# EAGLE design ESP32_EIT (EAGLE 9.7.0)
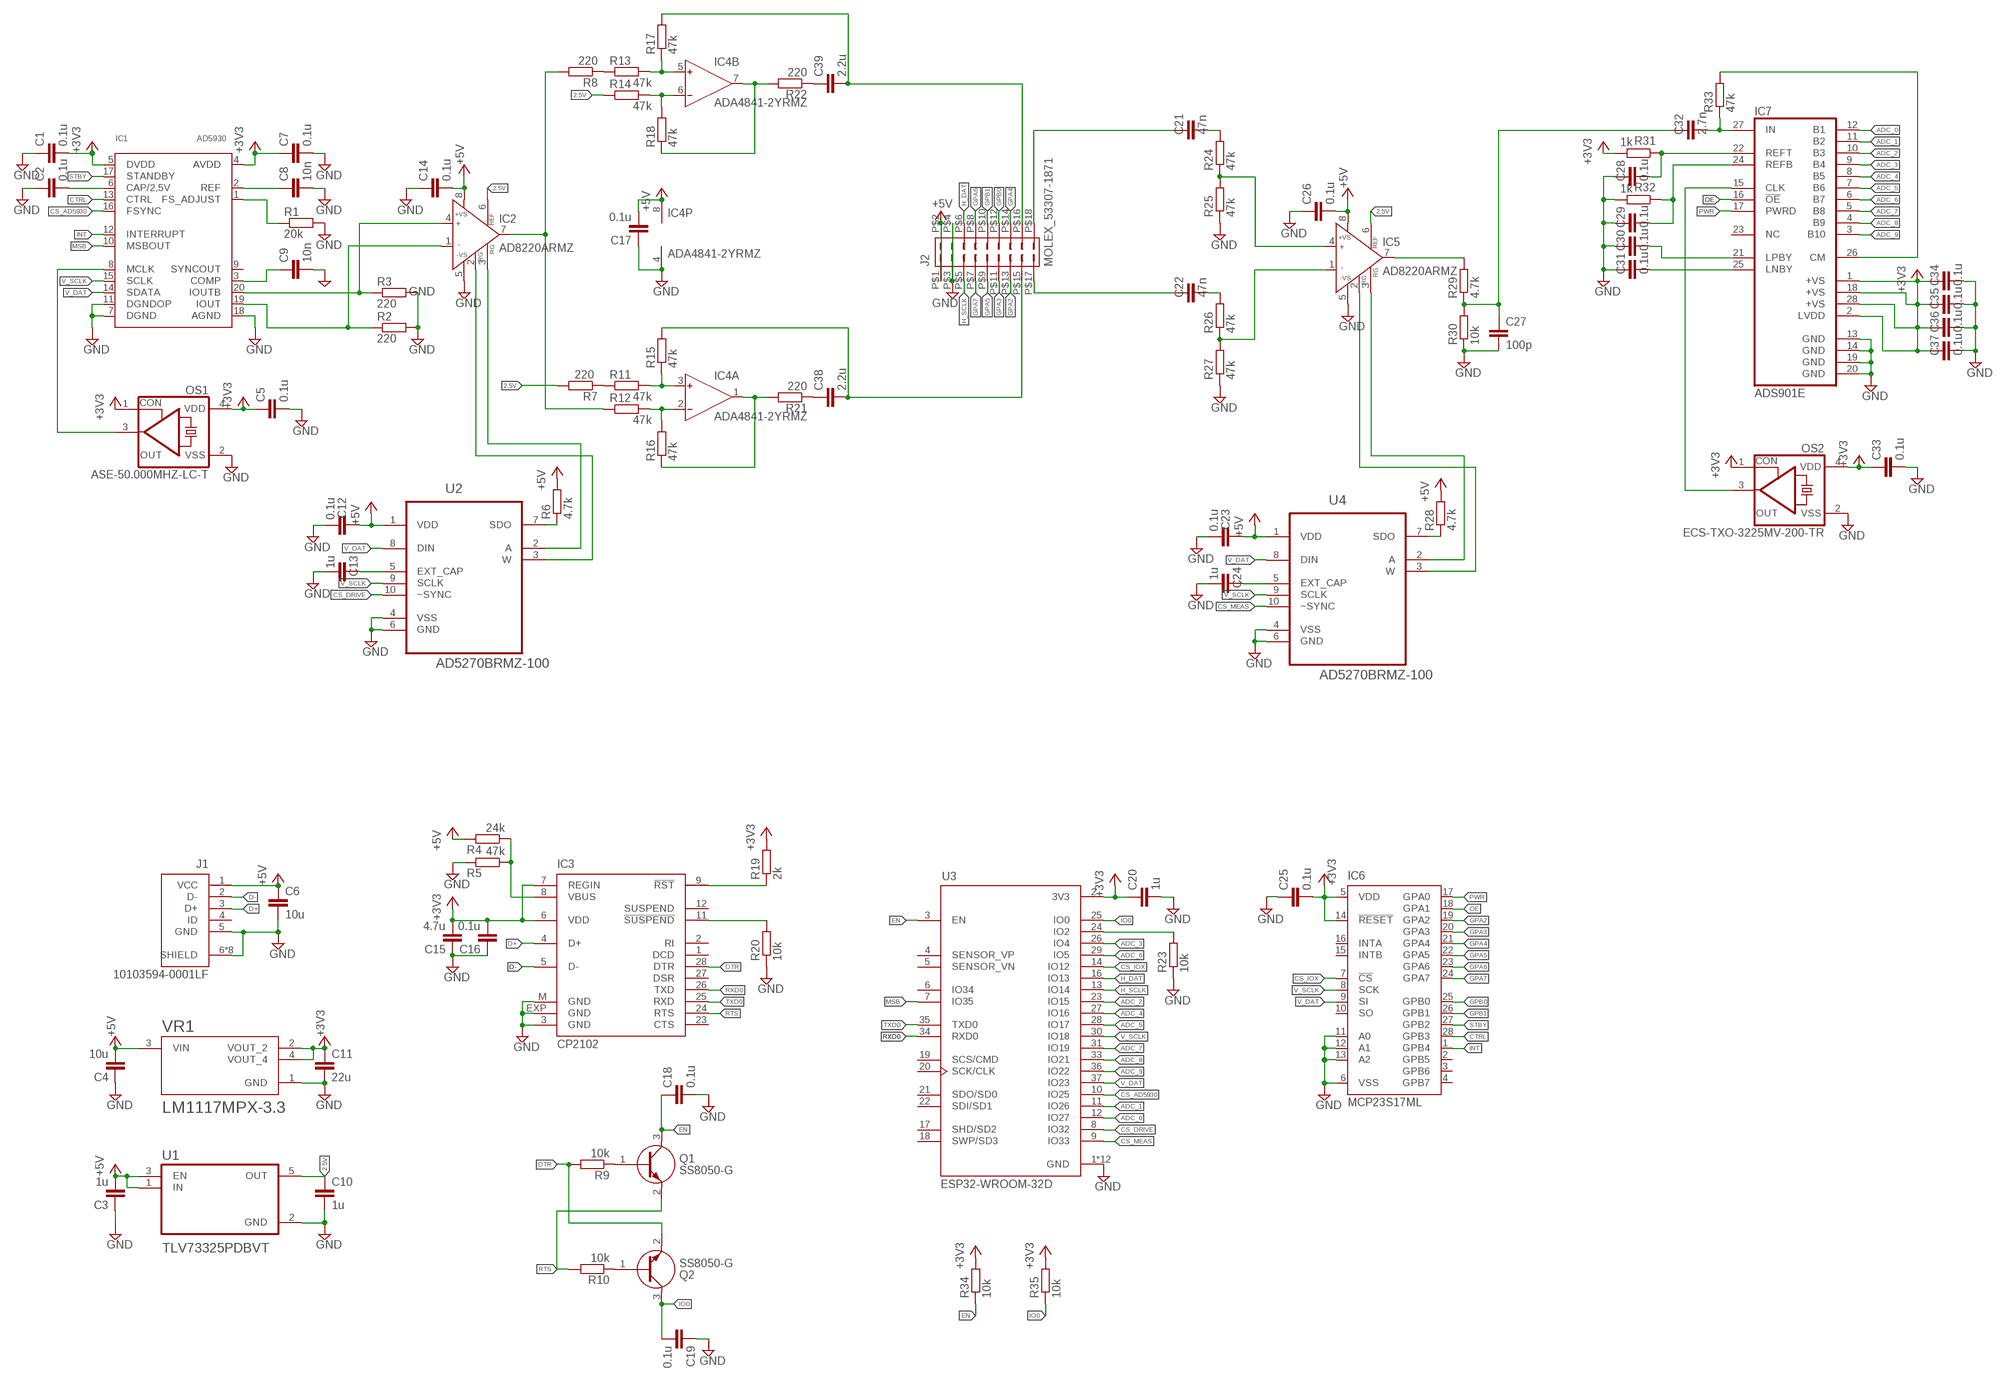
[diagram p0: schematic, sheet 1]

## Parts
C1  0.1u  C-EUC0603  [C0603]
C2  0.1u  C-EUC0603  [C0603]
C3  1u  C-EUC0603  [C0603]
C4  10u  C-EUC0805  [C0805]
C5  0.1u  C-EUC0603  [C0603]
C6  10u  C-EUC0805  [C0805]
C7  0.1u  C-EUC0603  [C0603]
C8  10n  C-EUC0603  [C0603]
C9  10n  C-EUC0603  [C0603]
C10  1u  C-EUC0603  [C0603]
C11  22u  C-EUC0805  [C0805]
C12  0.1u  C-EUC0603  [C0603]
C13  1u  C-EUC0603  [C0603]
C14  0.1u  C-EUC0603  [C0603]
C15  4.7u  C-EUC0603  [C0603]
C16  0.1u  C-EUC0603  [C0603]
C17  0.1u  C-EUC0603  [C0603]
C18  0.1u  C-EUC0603  [C0603]
C19  0.1u  C-EUC0603  [C0603]
C20  1u  C-EUC0603  [C0603]
C21  47n  C-EUC0603  [C0603]
C22  47n  C-EUC0603  [C0603]
C23  0.1u  C-EUC0603  [C0603]
C24  1u  C-EUC0603  [C0603]
C25  0.1u  C-EUC0603  [C0603]
C26  0.1u  C-EUC0603  [C0603]
C27  100p  C-EUC0603  [C0603]
C28  0.1u  C-EUC0603  [C0603]
C29  0.1u  C-EUC0603  [C0603]
C30  0.1u  C-EUC0603  [C0603]
C31  0.1u  C-EUC0603  [C0603]
C32  2.7n  C-EUC0603  [C0603]
C33  0.1u  C-EUC0603  [C0603]
C34  0.1u  C-EUC0603  [C0603]
C35  0.1u  C-EUC0603  [C0603]
C36  0.1u  C-EUC0603  [C0603]
C37  0.1u  C-EUC0603  [C0603]
C38  2.2u  C-EUC0603  [C0603]
C39  2.2u  C-EUC0603  [C0603]
IC1  AD5930  [TSSOP20]
IC2  AD8220ARMZ  [MSOP8]
IC3  CP2102  [MLP28]
IC4  ADA4841-2YRMZ  [MSOP8]
IC5  AD8220ARMZ  [MSOP8]
IC6  MCP23S17ML  [QFN28-ML_6X6MM]
IC7  ADS901E  [SSOP28BU]
J1  10103594-0001LF  [AMPHENOL_10103594-0001LF]
J2  MOLEX_53307-1871  [MOLEX_53307-1871]
OS1  ASE-50.000MHZ-LC-T  OSC-OE-IQXO-793  [2.5X2-4-PAD]
OS2  ECS-TXO-3225MV-200-TR  OSC-OE-IQXO-793  [2.5X2-4-PAD]
Q1  SS8050-G  [SOT95P240X115-3N]
Q2  SS8050-G  [SOT95P240X115-3N]
R1  20k  R-EU_R0603  [R0603]
R2  220  R-EU_R0603  [R0603]
R3  220  R-EU_R0603  [R0603]
R4  24k  R-EU_R0603  [R0603]
R5  47k  R-EU_R0603  [R0603]
R6  4.7k  R-EU_R0603  [R0603]
R7  220  R-EU_R0603  [R0603]
R8  220  R-EU_R0603  [R0603]
R9  10k  R-EU_R0603  [R0603]
R10  10k  R-EU_R0603  [R0603]
R11  47k  R-EU_R0603  [R0603]
R12  47k  R-EU_R0603  [R0603]
R13  47k  R-EU_R0603  [R0603]
R14  47k  R-EU_R0603  [R0603]
R15  47k  R-EU_R0603  [R0603]
R16  47k  R-EU_R0603  [R0603]
R17  47k  R-EU_R0603  [R0603]
R18  47k  R-EU_R0603  [R0603]
R19  2k  R-EU_R0603  [R0603]
R20  10k  R-EU_R0603  [R0603]
R21  220  R-EU_R0603  [R0603]
R22  220  R-EU_R0603  [R0603]
R23  10k  R-EU_R0603  [R0603]
R24  47k  R-EU_R0603  [R0603]
R25  47k  R-EU_R0603  [R0603]
R26  47k  R-EU_R0603  [R0603]
R27  47k  R-EU_R0603  [R0603]
R28  4.7k  R-EU_R0603  [R0603]
R29  4.7k  R-EU_R0603  [R0603]
R30  10k  R-EU_R0603  [R0603]
R31  1k  R-EU_R0603  [R0603]
R32  1k  R-EU_R0603  [R0603]
R33  47k  R-EU_R0603  [R0603]
R34  10k  R-EU_R0603  [R0603]
R35  10k  R-EU_R0603  [R0603]
U1  TLV73325PDBVT  [SOT95P280X145-5N]
U2  AD5270BRMZ-100  [SOP50P490X110-10N]
U3  ESP32-WROOM-32D  [MODULE_ESP32-WROOM-32D]
U4  AD5270BRMZ-100  [SOP50P490X110-10N]
VR1  LM1117MPX-3.3  [VREG_LM1117MPX-3.3]

## Nets
2.5V: C10.1 IC2.6(REF) IC5.6(REF) R7.2 R14.1 U1.5(OUT)
+3V3: C1.2 C5.1 C7.1 C11.1 C15.2 C16.2 C20.1 C25.2 C33.1 C34.1 C35.1 C36.1 C37.1 IC1.4(AVDD) IC1.5(DVDD) IC3.6(VDD) IC3.7(REGIN) IC6.5(VDD) IC6.14(!RESET) IC7.1(+VS) IC7.2(LVDD) IC7.18(+VS) IC7.28(+VS) OS1.1(CON) OS1.4(VDD) OS2.1(CON) OS2.4(VDD) R19.2 R31.2 R34.2 R35.2 U3.2(3V3) VR1.2(VOUT_2) VR1.4(VOUT_4)
+5V: C3.2 C4.2 C6.1 C12.1 C14.2 C17.2 C23.1 C26.2 IC2.8(+VS) IC4.8(P:V+) IC5.8(+VS) J1.1(VCC) J2.P$1 J2.P$2 R4.2 R6.2 R28.2 U1.1(IN) U1.3(EN) U2.1(VDD) U4.1(VDD) VR1.3(VIN)
ADC_0: IC7.12(B1) U3.12(IO27)
ADC_1: IC7.11(B2) U3.11(IO26)
ADC_2: IC7.10(B3) U3.23(IO15)
ADC_3: IC7.9(B4) U3.26(IO4)
ADC_4: IC7.8(B5) U3.27(IO16)
ADC_5: IC7.7(B6) U3.28(IO17)
ADC_6: IC7.6(B7) U3.29(IO5)
ADC_7: IC7.5(B8) U3.31(IO19)
ADC_8: IC7.4(B9) U3.33(IO21)
ADC_9: IC7.3(B10) U3.36(IO22)
CS_AD5930: IC1.16(FSYNC) U3.10(IO25)
CS_DRIVE: U2.10(~SYNC) U3.8(IO32)
CS_IOX: IC6.7(!CS) U3.14(IO12)
CS_MEAS: U3.9(IO33) U4.10(~SYNC)
CTRL: IC1.13(CTRL) IC6.28(GPB3)
D+: IC3.4(D+) J1.3(D+)
D-: IC3.5(D-) J1.2(D-)
DTR: IC3.28(DTR) Q2.2(E) R9.2
EN: C18.1 Q1.3(C) R34.1 U3.3(EN)
GND: C1.1 C2.1 C3.1 C4.1 C5.2 C6.2 C7.2 C8.2 C9.2 C10.2 C11.2 C12.2 C13.2 C14.1 C15.1 C16.1 C17.1 C18.2 C19.1 C20.2 C23.2 C24.2 C25.1 C26.1 C27.2 C28.1 C29.1 C30.1 C31.1 C33.2 C34.2 C35.2 C36.2 C37.2 IC1.7(DGND) IC1.11(DGNDOP) IC1.18(AGND) IC2.5(-VS) IC3.3(GND) IC3.EXP(GND) IC3.M(GND) IC4.4(P:V-) IC5.5(-VS) IC6.6(VSS) IC6.11(A0) IC6.12(A1) IC6.13(A2) IC7.13(GND) IC7.14(GND) IC7.19(GND) IC7.20(GND) J1.5(GND) J1.6(SHIELD) J1.7(SHIELD) J1.8(SHIELD) J1.9(SHIELD) J1.10(SHIELD) J1.11(SHIELD) J1.S1(SHIELD) J1.S2(SHIELD) J2.P$3 J2.P$4 OS1.2(VSS) OS2.2(VSS) R1.2 R2.2 R3.2 R5.2 R20.1 R23.1 R25.1 R27.1 R30.1 R32.2 U1.2(GND) U2.4(VSS) U2.6(GND) U3.1(GND) U3.15(GND) U3.38(GND) U3.39_1(GND) U3.39_2(GND) U3.39_3(GND) U3.39_4(GND) U3.39_5(GND) U3.39_6(GND) U3.39_7(GND) U3.39_8(GND) U3.39_9(GND) U4.4(VSS) U4.6(GND) VR1.1(GND)
GPA2: IC6.19(GPA2) J2.P$13
GPA3: IC6.20(GPA3) J2.P$11
GPA4: IC6.21(GPA4) J2.P$14
GPA5: IC6.22(GPA5) J2.P$9
GPA6: IC6.23(GPA6) J2.P$8
GPA7: IC6.24(GPA7) J2.P$7
GPB0: IC6.25(GPB0) J2.P$12
GPB1: IC6.26(GPB1) J2.P$10
H_DAT: J2.P$6 U3.16(IO13)
H_SCLK: J2.P$5 U3.13(IO14)
INT: IC1.12(INTERRUPT) IC6.1(GPB4)
IO0: C19.2 Q2.3(C) R35.1 U3.25(IO0)
MSB: IC1.10(MSBOUT) U3.7(IO35)
N$1: IC1.1(FS_ADJUST) R1.1
N$2: C8.1 IC1.2(REF)
N$3: C9.1 IC1.3(COMP)
N$4: IC1.20(IOUTB) IC2.4(IN+) R3.1
N$6: R7.1 R11.1
N$7: R8.1 R13.1
N$8: IC4.6(B:IN-) R14.2 R18.2
N$9: IC4.5(B:IN+) R13.2 R17.1
N$10: IC4.3(A:IN+) R11.2 R15.1
N$11: IC4.2(A:IN-) R12.2 R16.2
N$12: IC4.1(A:OUT) R16.1 R21.2
N$13: IC1.8(MCLK) OS1.3(OUT)
N$14: C2.2 IC1.6(CAP/2,5V)
N$15: IC4.7(B:OUT) R18.1 R22.2
N$16: R6.1 U2.7(SDO)
N$18: IC1.19(IOUT) IC2.1(IN-) R2.1
N$19: IC2.2(RG) U2.3(W)
N$20: IC2.7(OUT) R8.2 R12.1
N$21: IC2.3(RG) U2.2(A)
N$22: C13.1 U2.5(EXT_CAP)
N$23: R28.1 U4.7(SDO)
N$24: IC7.26(CM) R33.2
N$25: C32.2 IC7.27(IN) R33.1
N$26: C24.1 U4.5(EXT_CAP)
N$27: C28.2 IC7.22(REFT) R31.1
N$28: C29.2 IC7.24(REFB) R32.1
N$29: C31.2 IC7.25(LNBY)
N$30: C30.2 IC7.21(LPBY)
N$31: IC5.2(RG) U4.3(W)
N$32: IC7.15(CLK) OS2.3(OUT)
N$33: IC5.7(OUT) R29.2
N$34: C21.2 R24.2
N$35: IC5.4(IN+) R24.1 R25.2
N$36: IC5.1(IN-) R26.1 R27.2
N$37: C22.2 R26.2
N$39: IC5.3(RG) U4.2(A)
N$40: C27.1 C32.1 R29.1 R30.2
N$42: IC3.11(!SUSPEND) R20.2
N$43: IC3.8(VBUS) R4.1 R5.1
N$45: R23.2 U3.24(IO2)
N$71: IC3.9(!RST) R19.1
N$75: Q1.1(B) R9.1
N$76: Q2.1(B) R10.1
N$81: C21.1 J2.P$18
N$82: C22.1 J2.P$17
N$83: C38.2 J2.P$15 R15.2
N$84: C39.2 J2.P$16 R17.2
N$85: C38.1 R21.1
N$86: C39.1 R22.1
OE: IC6.18(GPA1) IC7.16(!OE)
PWR: IC6.17(GPA0) IC7.17(PWRD)
RTS: IC3.24(RTS) Q1.2(E) R10.2
RXD0: IC3.26(TXD) U3.34(RXD0)
STBY: IC1.17(STANDBY) IC6.27(GPB2)
TXD0: IC3.25(RXD) U3.35(TXD0)
V_DAT: IC1.14(SDATA) IC6.9(SI) U2.8(DIN) U3.37(IO23) U4.8(DIN)
V_SCLK: IC1.15(SCLK) IC6.8(SCK) U2.9(SCLK) U3.30(IO18) U4.9(SCLK)
Unconnected: IC1.9(SYNCOUT) IC3.1(DCD) IC3.2(RI) IC3.12(SUSPEND) IC3.23(CTS) IC3.27(DSR) IC6.2(GPB5) IC6.3(GPB6) IC6.4(GPB7) IC6.10(SO) IC6.15(INTB) IC6.16(INTA) IC7.23(NC) J1.4(ID) U3.4(SENSOR_VP) U3.5(SENSOR_VN) U3.6(IO34) U3.17(SHD/SD2) U3.18(SWP/SD3) U3.19(SCS/CMD) U3.20(SCK/CLK) U3.21(SDO/SD0) U3.22(SDI/SD1)

## Library data of the parts
C1-C39 = rcl:C-EU: CAPACITOR, European symbol; SPICEPREFIX: C
IC1 = AD5930:AD5930: Programmable Waveform Generator Output up to 25MHz Serial Interface Check prices <https://pricing.snapeda.com/parts/AD5930/Analog%20Devices/view-part?ref=eda>; AVAILABILITY: In Stock; DESCRIPTION: Direct Digital Synthesis IC 10 b 50MHz 24 b Tuning 20-TSSOP; MF: Analog Devices; MP: AD5930; PACKAGE: TSSOP-20 Analog Devices; PRICE: None
IC2 IC5 = ESP32_EIT:AD8220: Single-Supply, Rail-to-Rail, Low Power, FET Input Op Amp Source: http://www.analog.com/static/imported-files/data_sheets/AD820.pdf
IC3 = silabs:CP210*: Single-Chip USB to UART Bridge Source: www.silabs.com .. CP2101.pdf / cp2102.pdf; MF: FARNELL; MPN: CP2102-GM; OC_FARNELL: 9282130; OC_NEWARK: 30K5635
IC4 = ESP32_EIT:ADA4841-2: Ultralow Noise Amplifier at Lower Power Source: http://www.analog.com/static/imported-files/data_sheets/ADA4075-2.pdf
IC6 = microchip:MCP23S17: http://ww1.microchip.com/downloads/en/DeviceDoc/21952a.pdf Source: http://ww1.microchip.com/downloads/en/DeviceDoc/21952a.pdf; MF: MICROCHIP; MPN: MCP23S17-E/ML; OC_FARNELL: unknown; OC_NEWARK: 31K2949
IC7 = burr-brown:ADS901: 10-Bit, 20 MSPS ADC SE/Diff Inputs Ext Reference and Adjustable Fullscale Range; MF: TEXAS INSTRUMENT CONNECTORS; MPN: ADS901E; OC_FARNELL: 1509526; OC_NEWARK: 35C1591
J1 = 10103594-0001LF:10103594-0001LF: USB - micro B USB 2.0 Receptacle Connector 5 Position Surface Mount, Right Angle; Through Hole Check prices <https://pricing.snapeda.com/parts/10103594-0001LF/Amphenol%20ICC%20%28FCI%29/view-part?ref=eda>; AVAILABILITY: In Stock; DESCRIPTION: USB - micro B USB 2.0 Receptacle Connector 5 Position Surface Mount, Right Angle; Through Hole; MF: Amphenol ICC (FCI); MP: 10103594-0001LF; PACKAGE: None; PRICE: None
J2 = ESP32_EIT:MOLEX_53307-1871
OS1 OS2 = IQD-Frequency-Products:OSC-OE: OSCILLATOR WITH OE
Q1 Q2 = SS8050-G:SS8050-G: Bipolar Transistors - BJT NPN TRANSISTOR 1.5A 40V Source: Datasheet <http://www.comchiptech.com/admin/files/product/SS8050-G RevA181526.pdf> Check prices <https://pricing.snapeda.com/parts/SS8050-G/Comchip%20Technology/view-part?ref=eda>; AVAILABILITY: In Stock; DESCRIPTION: Bipolar (BJT) Transistor NPN 25V 1.5A 100MHz 300mW Surface Mount SOT-23; MF: Comchip Technology; MP: SS8050-G; PACKAGE: TO-236 Comchip; PRICE: None
R1-R35 = rcl:R-EU_: RESISTOR, European symbol; SPICEPREFIX: R
U1 = TLV73325PDBVT:TLV73325PDBVT: Check prices <https://pricing.snapeda.com/parts/TLV73325PDBVT/Texas%20Instruments/view-part?ref=eda>; AVAILABILITY: In Stock; DESCRIPTION: 300-mA, capacitor-free, low-IQ, low-dropout voltage regulator with enable 5-SOT-23 -40 to 125; MF: Texas Instruments; MP: TLV73325PDBVT; PACKAGE: SOT-23-5 Texas Instruments; PRICE: None; PURCHASE-URL: https://pricing.snapeda.com/search/part/TLV73325PDBVT/?ref=eda
U2 U4 = AD5270BRMZ-100:AD5270BRMZ-100: 1024-/256-Position, 1% Resistor Tolerance Error, SPI Interface and 50-TP Memory Digital Rheostat Check prices <https://pricing.snapeda.com/parts/AD5270BRMZ-100/Analog%20Devices/view-part?ref=eda>; AVAILABILITY: In Stock; DESCRIPTION: Digital Potentiometer 100k Ohm 1 Circuit 1024 Taps SPI Interface 10-MSOP; MF: Analog Devices; MP: AD5270BRMZ-100; PACKAGE: MSOP-10 Analog Devices; PRICE: None
U3 = ESP32-WROOM-32D:ESP32-WROOM-32D: Bluetooth, WiFi 802.11b/g/n, Bluetooth v4.2 + EDR, Class 1, 2 and 3 Transceiver Module 2.4GHz ~ 2.5GHz Integrated, Trace Surface Mount Check prices <https://pricing.snapeda.com/parts/ESP32-WROOM-32D/Espressif%20Systems/view-part?ref=eda>; AVAILABILITY: In Stock; DESCRIPTION: Bluetooth, WiFi 802.11b/g/n, Bluetooth v4.2 +EDR, Class 1, 2 and 3 Transceiver Module 2.4GHz ~ 2.5GHz Integrated; MF: Espressif Systems; MP: ESP32-WROOM-32D; PACKAGE: Module Espressif Systems; PRICE: None
VR1 = LM1117MPX-3.3:LM1117MPX-3.3: 800-mA 15-V linear voltage regulator 4-SOT-223 0 to 125 Check prices <https://pricing.snapeda.com/parts/LM1117MPX-3.3/Texas%20Instruments/view-part?ref=eda>; AVAILABILITY: In Stock; DESCRIPTION: 800-mA 15-V linear voltage regulator 4-SOT-223; MF: Texas Instruments; MP: LM1117MPX-3.3; PACKAGE: SOT-223-4 Texas Instruments; PRICE: None; PURCHASE-URL: https://pricing.snapeda.com/search/part/LM1117MPX-3.3/?ref=eda

## Board
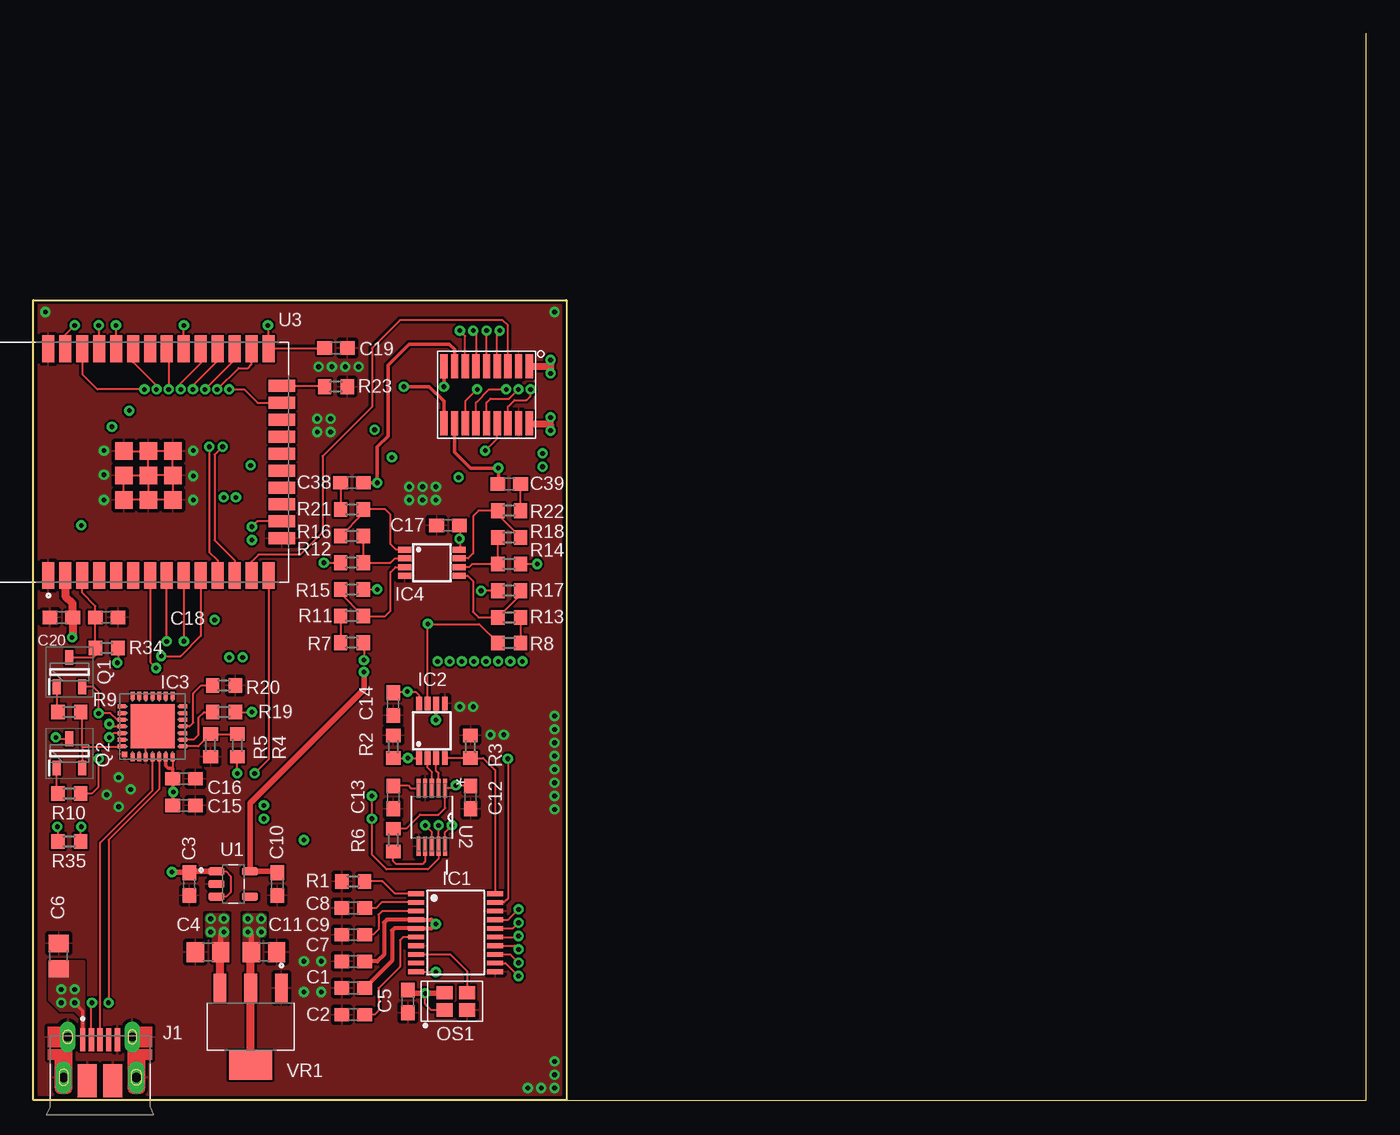
[diagram p1: board, top side]
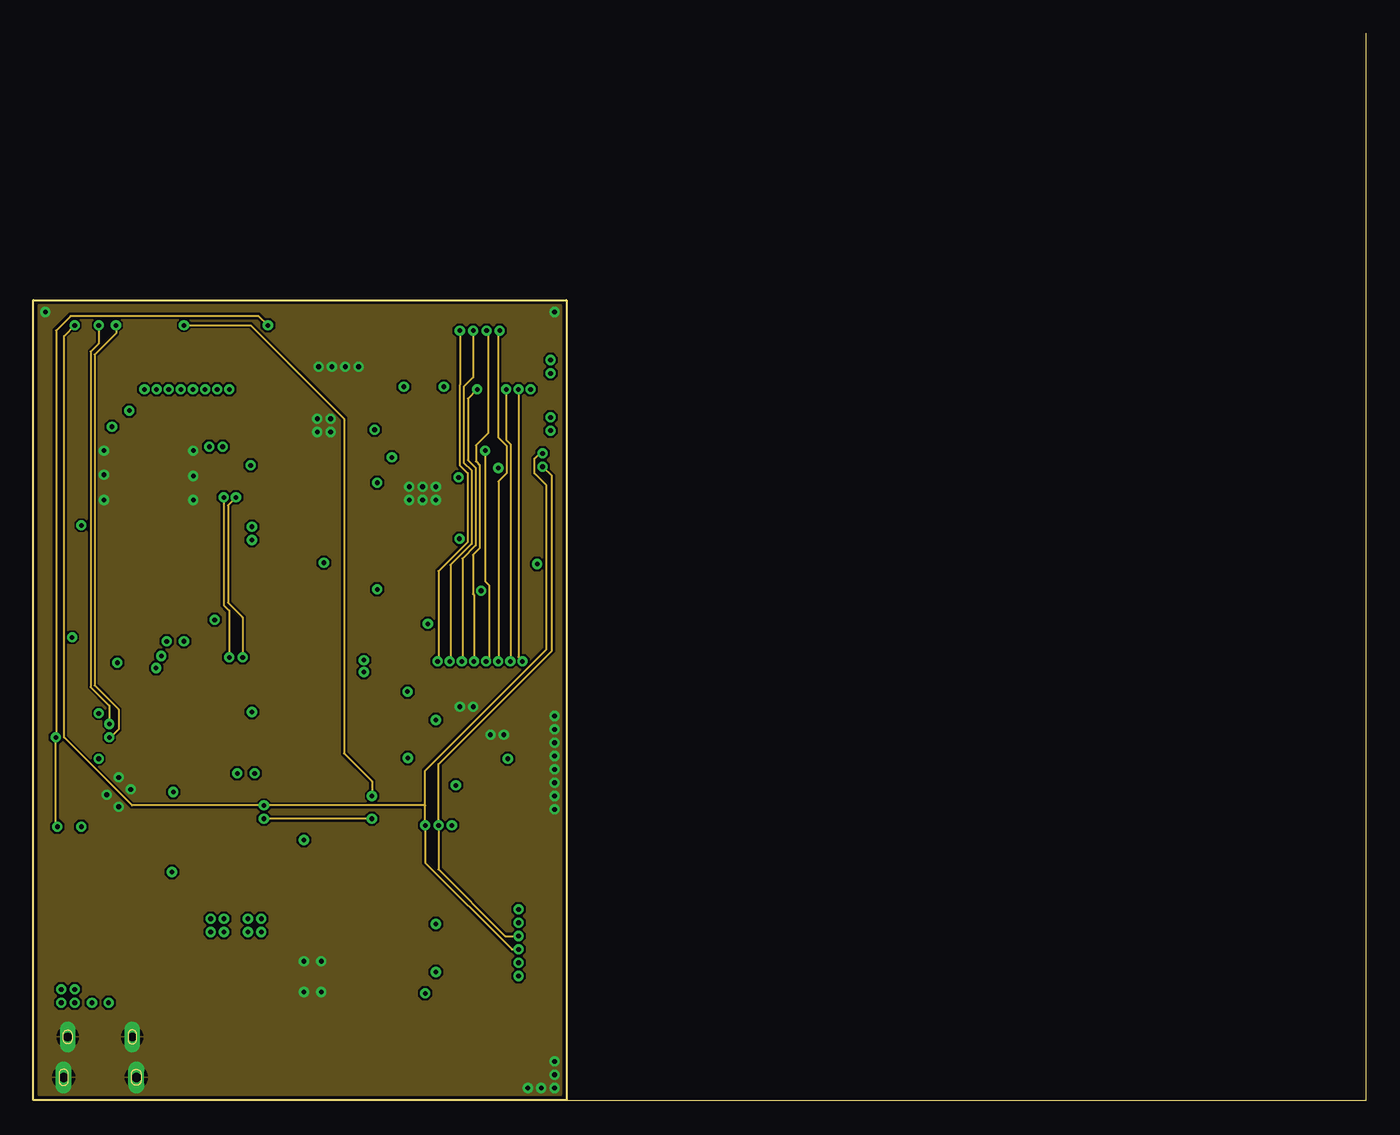
[diagram p2: board, inner layer Inner1]
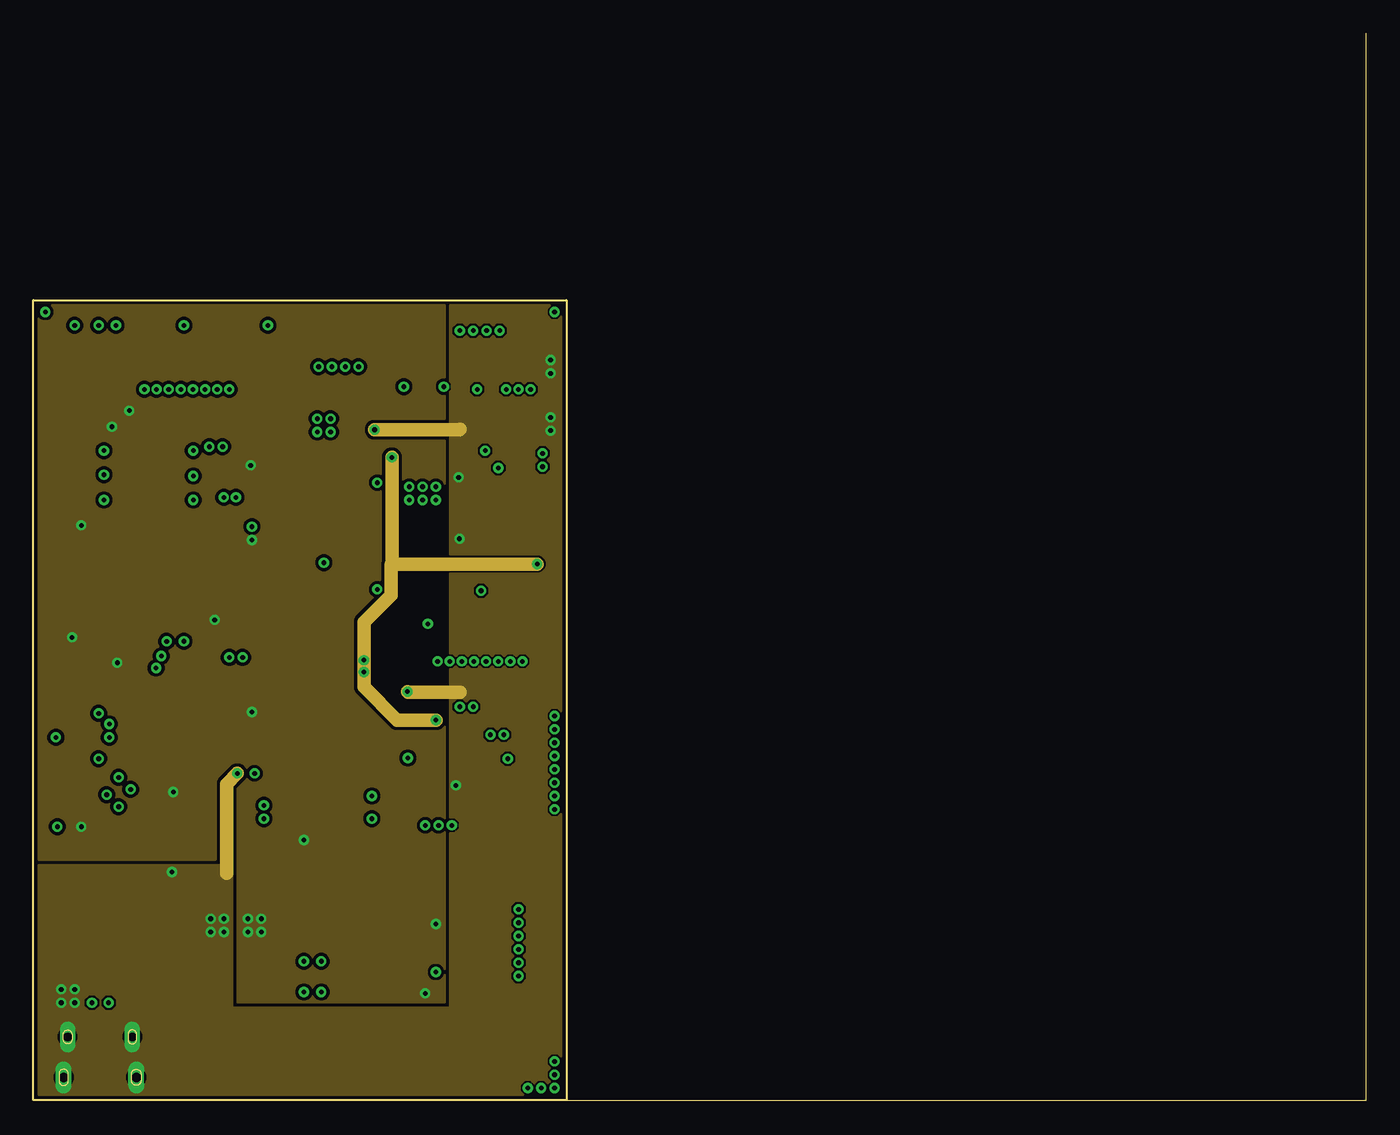
[diagram p3: board, inner layer Inner2]
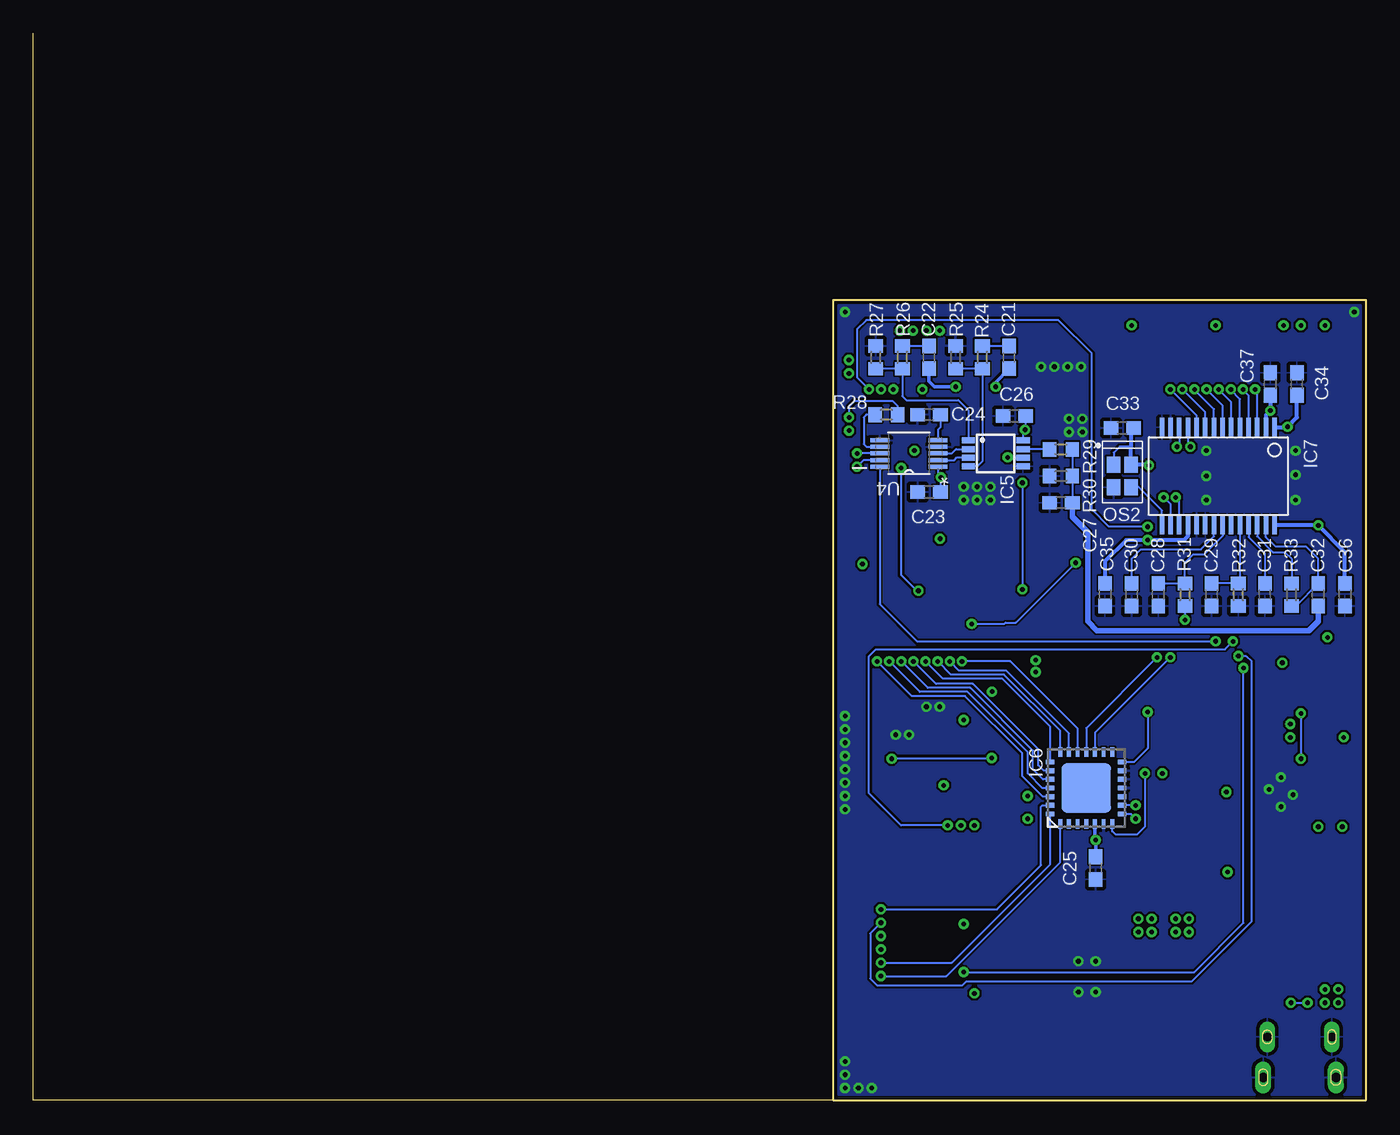
[diagram p4: board, bottom side, seen from below]

Size 100 x 80 mm. Coordinates in mm from the lower left corner, seen from the top.
Outline: 40,0 100,0 100,80
Outline: 40,0 40,60 0,60 0,0 40,0
Copper layers (1+2*15+16): Top 0.035mm / dielectric 1.5mm / Inner1 0.035mm / dielectric 0.15mm / Inner2 0.035mm / dielectric 0.2mm / Bottom 0.035mm
Design rules "default *": minimum track width 6mil, minimum drill 0.35mm, track to track 6mil, track to pad 6mil, pad to pad 6mil, via to via 6mil, smd to smd 6mil, copper to edge 10mil, drill to drill 6mil, minimum pad ring 10mil, minimum via ring 8mil, stop-mask expansion 4mil, vias tented up to drill 0mil, thermal gap 10mil

### Footprints (pad centres in the part's own frame; a part is rotated, then mirrored left to right if it is on the bottom)
C0603 = smd 1.1 x 1: 1 -0.85,0; 2 0.85,0
C0805 = smd 1.3 x 1.5: 1 -0.95,0; 2 0.95,0
TSSOP20 = smd 0.35 x 1.2: 1 -2.275,-2.97; 2 -1.625,-2.97; 3 -0.975,-2.97; 4 -0.325,-2.97; 5 0.325,-2.97; 6 0.975,-2.97; 7 1.625,-2.97; 8 2.275,-2.97; 9 2.925,-2.97; 10 3.575,-2.97; 11 3.575,2.97; 12 2.925,2.97; 13 2.275,2.97; 14 1.625,2.97; 15 0.975,2.97; 16 0.325,2.97; 17 -0.325,2.97; 18 -0.975,2.97; 19 -1.625,2.97; 20 -2.275,2.97
MSOP8 = smd 0.45 x 1: 1 -0.975,-2.05; 2 -0.325,-2.05; 3 0.325,-2.05; 4 0.975,-2.05; 5 0.975,2.05; 6 0.325,2.05; 7 -0.325,2.05; 8 -0.975,2.05
MLP28 = smd 0.6 x 0.3: 1 -2.3,1.5; 2 -2.3,1; 3 -2.3,0.5; 4 -2.3,0; 5 -2.3,-0.5; 6 -2.3,-1; 7 -2.3,-1.5; 15 2.3,-1.5; 16 2.3,-1; 17 2.3,-0.5; 18 2.3,0; 19 2.3,0.5; 20 2.3,1; 21 2.3,1.5 | smd 0.3 x 0.6: 8 -1.5,-2.3; 9 -1,-2.3; 10 -0.5,-2.3; 11 0,-2.3; 12 0.5,-2.3; 13 1,-2.3; 14 1.5,-2.3; 22 1.5,2.3; 23 1,2.3; 24 0.5,2.3; 25 0,2.3; 26 -0.5,2.3; 27 -1,2.3; 28 -1.5,2.3 | smd 3.3 x 3.3: EXP 0,0 | smd 0.435 x 0.435: M -2.103,2.103
QFN28-ML_6X6MM = smd 0.7 x 0.35: 1 -2.7,1.95; 2 -2.7,1.3; 3 -2.7,0.65; 4 -2.7,0; 5 -2.7,-0.65; 6 -2.7,-1.3; 7 -2.7,-1.95; 15 2.7,-1.95; 16 2.7,-1.3; 17 2.7,-0.65; 18 2.7,0; 19 2.7,0.65; 20 2.7,1.3; 21 2.7,1.95 | smd 0.35 x 0.7: 8 -1.95,-2.7; 9 -1.3,-2.7; 10 -0.65,-2.7; 11 0,-2.7; 12 0.65,-2.7; 13 1.3,-2.7; 14 1.95,-2.7; 22 1.95,2.7; 23 1.3,2.7; 24 0.65,2.7; 25 0,2.7; 26 -0.65,2.7; 27 -1.3,2.7; 28 -1.95,2.7 | smd 3.7 x 3.7: EXP 0,0
SSOP28BU = smd 0.348 x 1.397: 1 -4.225,-3.656; 2 -3.575,-3.656; 3 -2.925,-3.656; 4 -2.275,-3.656; 5 -1.625,-3.656; 6 -0.975,-3.656; 7 -0.325,-3.656; 8 0.325,-3.656; 9 0.975,-3.656; 10 1.625,-3.656; 11 2.275,-3.656; 12 2.925,-3.656; 13 3.575,-3.656; 14 4.225,-3.656; 15 4.225,3.656; 16 3.575,3.656; 17 2.925,3.656; 18 2.275,3.656; 19 1.625,3.656; 20 0.975,3.656; 21 0.325,3.656; 22 -0.325,3.656; 23 -0.975,3.656; 24 -1.625,3.656; 25 -2.275,3.656; 26 -2.925,3.656; 27 -3.575,3.656; 28 -4.225,3.656
AMPHENOL_10103594-0001LF = smd 0.4 x 1.75: 1 -1.3,2.825; 2 -0.65,2.825; 3 0,2.825; 4 0.65,2.825; 5 1.3,2.825 | drill 0.65 pad 0.73 long: 6 -2.425,3.03; 7 2.425,3.03 | drill 0.7 pad 1.2 long: 8 -2.725,0; 9 2.725,0 | smd 1.05 x 2.1 bottom: 10 -2.425,3.03; 11 2.425,3.03 | smd 1.425 x 2.5: S1 -0.963,-0.25; S2 0.963,-0.25
MOLEX_53307-1871 = smd 0.55 x 1.8: P$1 3.2,2.15; P$2 3.2,-2.15; P$3 2.4,2.15; P$4 2.4,-2.15; P$5 1.6,2.15; P$6 1.6,-2.15; P$7 0.8,2.15; P$8 0.8,-2.15; P$9 0,2.15; P$10 0,-2.15; P$11 -0.8,2.15; P$12 -0.8,-2.15; P$13 -1.6,2.15; P$14 -1.6,-2.15; P$15 -2.4,2.15; P$16 -2.4,-2.15; P$17 -3.2,2.15; P$18 -3.2,-2.15
2.5X2-4-PAD = smd 1.2 x 1: 1 -0.85,-0.65; 2 0.85,-0.65; 3 0.85,0.65; 4 -0.85,0.65
SOT95P240X115-3N = smd 1.1 x 0.6: 1 -1.1,0.95; 2 -1.1,-0.95; 3 1.1,0
R0603 = smd 1 x 1.1: 1 -0.85,0; 2 0.85,0
SOT95P280X145-5N = smd 1.21 x 0.59: 1 -1.255,0.95; 2 -1.255,0; 3 -1.255,-0.95; 4 1.255,-0.95; 5 1.255,0.95
SOP50P490X110-10N = smd 1.422 x 0.305: 1 -2.184,0.991; 2 -2.184,0.508; 3 -2.184,0; 4 -2.184,-0.508; 5 -2.184,-0.991; 6 2.184,-0.991; 7 2.184,-0.508; 8 2.184,0; 9 2.184,0.508; 10 2.184,0.991
MODULE_ESP32-WROOM-32D = smd 2 x 0.9: 1 -8.5,5.26; 2 -8.5,3.99; 3 -8.5,2.72; 4 -8.5,1.45; 5 -8.5,0.18; 6 -8.5,-1.09; 7 -8.5,-2.36; 8 -8.5,-3.63; 9 -8.5,-4.9; 10 -8.5,-6.17; 11 -8.5,-7.44; 12 -8.5,-8.71; 13 -8.5,-9.98; 14 -8.5,-11.25; 25 8.5,-11.25; 26 8.5,-9.98; 27 8.5,-8.71; 28 8.5,-7.44; 29 8.5,-6.17; 30 8.5,-4.9; 31 8.5,-3.63; 32 8.5,-2.36; 33 8.5,-1.09; 34 8.5,0.18; 35 8.5,1.45; 36 8.5,2.72; 37 8.5,3.99; 38 8.5,5.26 | smd 0.9 x 2: 15 -5.715,-12.25; 16 -4.445,-12.25; 17 -3.175,-12.25; 18 -1.905,-12.25; 19 -0.635,-12.25; 20 0.635,-12.25; 21 1.905,-12.25; 22 3.175,-12.25; 23 4.445,-12.25; 24 5.715,-12.25 | smd 1.33 x 1.33: 39_1 -2.835,-0.405; 39_2 -1,-0.405; 39_3 0.835,-0.405; 39_4 -2.835,-2.24; 39_5 -1,-2.24; 39_6 0.835,-2.24; 39_7 -2.835,-4.075; 39_8 -1,-4.075; 39_9 0.835,-4.075
VREG_LM1117MPX-3.3 = smd 2.15 x 0.95: 1 -2.9,2.3; 2 -2.9,0; 3 -2.9,-2.3 | smd 2.15 x 3.25: 4 2.9,0

### Placement (x,y rotation side)
C1  24,8.4 0 top
C2  24,6.4 0 top
C3  11.7,16.2 90 top
C4  13.1,11.1 0 top
C5  28.1,7.4 270 top
C6  1.9,10.8 90 top
C7  24,10.4 180 top
C8  24,14.4 180 top
C9  24,12.4 180 top
C10  18.3,16.2 270 top
C11  17.3,11.1 0 top
C12  32.8,22.7 270 top
C13  27,22.7 270 top
C14  27,29.7 90 top
C15  11.3,22.1 180 top
C16  11.3,24.1 180 top
C17  31.1,43.1 0 top
C18  5.5,36.2 0 top
C19  22.7,56.4 180 top
C20  2.1,36.2 180 top
C21  26.8,55.7 90 bottom
C22  32.8,55.7 90 bottom
C23  32.8,45.6 180 bottom
C24  32.8,51.4 180 bottom
C25  20.3,17.4 90 bottom
C26  26.4,51.3 0 bottom
C27  22.9,44.8 180 bottom
C28  15.6,37.9 90 bottom
C29  11.6,37.9 90 bottom
C30  17.6,37.9 90 bottom
C31  7.6,37.9 90 bottom
C32  3.6,37.9 90 bottom
C33  18.3,50.4 180 bottom
C34  5.2,53.7 90 bottom
C35  19.6,37.9 270 bottom
C36  1.6,37.9 270 bottom
C37  7.2,53.7 90 bottom
C38  23.9,46.3 0 top
C39  35.7,46.2 180 top
IC1  31.69,13.2 270 top
IC2  29.9,27.7 0 top
IC3  8.94,28.02 90 top
IC4  29.9,40.3 270 top
IC5  27.8,48.5 270 bottom
IC6  21,23.4 90 bottom
IC7  11.1,46.8 180 bottom
J1  5,1.7 0 top
J2  34,52.9 0 top
OS1  31.7,7.4 0 top
OS2  18.3,46.8 270 bottom
Q1  2.7,32.1 90 top
Q2  2.7,25.99 90 top
R1  24,16.4 180 top
R2  27,26.5 90 top
R3  32.8,26.5 90 top
R4  15.3,26.6 270 top
R5  13.3,26.6 270 top
R6  27,19.5 90 top
R7  23.9,34.3 0 top
R8  35.71,34.28 180 top
R9  2.7,29.1 0 top
R10  2.7,23 0 top
R11  23.9,36.3 0 top
R12  23.9,40.3 0 top
R13  35.7,36.2 180 top
R14  35.7,40.2 180 top
R15  23.9,38.3 0 top
R16  23.9,42.3 0 top
R17  35.7,38.2 180 top
R18  35.7,42.2 180 top
R19  14.3,29.1 0 top
R20  14.3,31.1 180 top
R21  23.9,44.3 0 top
R22  35.7,44.2 180 top
R23  22.7,53.5 180 top
R24  28.8,55.7 90 bottom
R25  30.8,55.7 270 bottom
R26  34.8,55.7 90 bottom
R27  36.8,55.7 270 bottom
R28  36,51.4 0 bottom
R29  22.9,48.8 180 bottom
R30  22.9,46.8 0 bottom
R31  13.6,37.9 270 bottom
R32  9.6,37.9 270 bottom
R33  5.6,37.9 90 bottom
R34  5.5,33.9 0 top
R35  2.7,19.4 0 top
U1  15,16.2 0 top
U2  29.9,21.2 270 top
U3  6.39,47.84 90 top
U4  34.3,48.5 180 bottom
VR1  16.3,5.5 270 top

### Tracks (layer width: path | path; a pad name or v marks a point on that pad's centre or on a via)
2.5V  (via drill 0.35)
  Top 0.152: v37.8,40.2 R14.1 | R7.2 24.8,34.25 v24.8,32.99
  Top 0.254: IC2.6 30.23,28.52 v30.2,28.5
  Top 0.406: C10.1 18.2,17.15 U1.5 16.25,22.25 24.8,30.8 v24.8,32.1
  Inner2 1.016: v26.9,48.2 26.9,40.2 | v37.8,40.2 26.9,40.2 | v30.2,28.5 27.3,28.5 24.8,31 v24.8,32.1 v24.8,32.99 24.8,35.83 26.84,37.87 26.84,40.14 26.9,40.2
  Bottom 0.254: IC5.6 26.88,48.17 v26.9,48.2
+3V3  (via drill 0.35)
  Top 0.152: R19.2 v16.4,29.1 | IC3.7 10.44,24.86 10.45,24.85 | OS1.1 29.85,6.75 29.4,7.2 v29.4,8 | R35.2 3.55,20.45 v3.6,20.5 | R34.2 6.35,32.85 v6.3,32.8
  Top 0.254: C15.2 10.5,22.15 v10.5,23.1 10.5,24.05 C16.2 10.45,24.85 10.4,24.9 10.1,24.9 9.94,25.06 IC3.6
  Top 0.305: C7.1 25.8,10.4 26.3,10.9 26.3,13.3 26.52,13.53 IC1.4 29.88,13.53 v30.2,13.2 29.88,12.88 IC1.5 27.07,12.88 26.9,12.7 26.9,10.45 C1.2 | 28.3,8.05 C5.1
  Top 0.406: v16.1,12.6 16.35,12.35 C11.1 | OS1.4 30.8,8 v29.4,8 28.35,8 28.3,8.05
  Top 0.61: VR1.4 VR1.2 16.3,11.05 C11.1 | U3.2 2.4,37.8 2.95,37.25 C20.1 2.95,34.75 v2.91,34.71 v2.91,34.7
  Bottom 0.152: 17.65,49 18.5,49 18.95,48.55 OS2.1 | v16.4,29.1 16.4,26.4 17.45,25.35 IC6.14 | R31.2 v13.6,36.01
  Bottom 0.254: IC6.5 20.35,19.55 v20.3,19.5 C25.2
  Bottom 0.305: v16.3,47.6 16.35,47.65 OS2.4 17.65,49 17.65,50.2 C33.1 | IC7.1 5.94,50.46 v5.9,50.5 5.2,51.2 C34.1 | IC7.2 7.53,51.38 v7.2,51.7 C37.1 | IC7.18 13.4,43.12 13.4,42.3 13.7,42 v16.4,42 18,42 19.6,40.4 C35.1 | C36.1 1.6,41.1 v3.6,43.1 3.64,43.14 IC7.28
  other vias: 16.1,13.6 17.1,13.6 17.1,12.6
  pour Top (no thermals): 15.7,14 17.5,14 17.5,12.2 17,12.2 17,11.6 15.7,11.6
  pour Inner2 (isolate 0.254, rank 2): 0,60 0,17.7 15,17.7 15,7 31.2,7 31.2,60
+5V  (via drill 0.35)
  Top 0.152: U1.1 14.45,17.15 14.8,16.8 14.8,15.6 14.45,15.25 U1.3 | C12.1 32.75,23.6 v31.7,23.6 31.48,23.38 U2.1 30.9,21.9 30.4,21.4 29,21.4 27.95,20.35 R6.2 | C17.2 32,43.05 32,42.07 | 32,42.07 32,41.33 IC4.8 | C14.2 27.05,30.6 28.1,30.6 | 28.1,30.6 28.7,30.6 28.93,30.38 IC2.8 | v15.3,24.5 R4.2 | 32,42.07 v31.98,42.09 | v28.07,30.63 28.1,30.6
  Top 0.254: J1.1 3.7,6.7 v3.1,7.3
  Top 0.406: U1.1 11.8,17.15 C3.2 11.65,17.1 v10.4,17.1 | C4.2 14.05,12.35 v14.3,12.6
  Top 0.508: 38.8,50.7 v38.8,51.2 | 38.8,50.7 v38.8,50.2 | 38.8,50.7 37.25,50.7 J2.P$2 | 38.8,55 37.25,55 J2.P$1 | v38.81,55.5 v38.8,55.49 38.8,55 | 38.8,55 v38.8,54.51 v38.81,54.5
  Top 0.61: VR1.3 14,11.05 C4.2
  Inner2 1.016: v15.3,24.5 14.5,23.7 14.5,17 | 32,30.6 28.1,30.6 v28.07,30.63 | v25.6,50.27 31.97,50.27 32,50.3
  Bottom 0.152: C26.2 25.55,50.32 v25.6,50.27 25.75,50.12 IC5.8 | C23.1 31.9,45.65 v31.9,46.7 32.12,46.92 U4.1 | R28.2 35.15,52.05 35.5,52.4 38.4,52.4 38.8,52 v38.8,51.2
  other vias: 3.1,8.3 2.1,8.3 2.1,7.3 13.3,13.6 14.3,13.6 13.3,12.6
  pour Top (no thermals): 3.88,10.48 1.12,10.48 1.12,7.47 1.97,6.62 3.07,6.62 3.52,6.17 3.52,5.12 3.88,5.12
  pour Top (no thermals): 12.9,12.2 12.9,14 14.7,14 14.7,11.6 13.4,11.6 13.4,12.2
  pour Inner2: 0,0 0,17.7 15,17.7 15,7 31.2,7 31.2,60 40,60 40,0
ADC_0  (via drill 0.35)
  Top 0.152: v14.2,49 13.6,48.4 13.6,42 15.1,40.5 U3.12
  Bottom 0.152: IC7.12 14.03,49.17 v14.2,49
ADC_1  (via drill 0.35)
  Top 0.152: v13.2,49 13.2,41.1 13.83,40.47 U3.11
  Bottom 0.152: IC7.11 13.38,49.17 v13.2,49
ADC_2  (via drill 0.35)
  Top 0.152: v14.7,53.3 15.8,53.3 16.82,52.28 U3.23
  Bottom 0.152: IC7.10 12.72,51.33 v14.7,53.3
ADC_3  (via drill 0.35)
  Top 0.152: v13.79,53.3 15.39,54.9 16.1,54.9 16.37,55.17 U3.26
  Bottom 0.152: IC7.9 12.07,51.58 v13.79,53.29 v13.79,53.3
ADC_4  (via drill 0.35)
  Top 0.152: v12.88,53.3 15.1,55.52 U3.27
  Bottom 0.152: IC7.8 11.43,51.83 12.88,53.28 v12.88,53.3
ADC_5  (via drill 0.35)
  Top 0.152: v11.97,53.3 11.97,53.57 13.83,55.43 U3.28
  Bottom 0.152: IC7.7 10.78,52.08 11.97,53.27 v11.97,53.3
ADC_6  (via drill 0.35)
  Top 0.152: v11.06,53.3 11.06,53.77 12.56,55.26 U3.29
  Bottom 0.152: IC7.6 10.12,52.33 11.06,53.27 v11.06,53.3
ADC_7  (via drill 0.35)
  Top 0.152: v10.16,53.3 10.16,56.2 U3.31
  Bottom 0.152: IC7.5 9.47,52.58 10.16,53.26 v10.16,53.3
ADC_8  (via drill 0.35)
  Top 0.152: U3.33 7.48,55.32 9.25,53.55 v9.25,53.3
  Bottom 0.152: IC7.4 8.82,52.83 9.25,53.25 v9.25,53.3
ADC_9  (via drill 0.35)
  Top 0.152: U3.36 3.67,54.43 4.8,53.3 v8.34,53.3
  Bottom 0.152: IC7.3 8.18,53.08 8.34,53.24 v8.34,53.3
CS_AD5930  (via drill 0.35)
  Top 0.152: IC1.16 35.98,12.88 v36.4,13.3 | U3.10 12.56,34.81 11.05,33.3 v9.6,33.3
  Bottom 0.152: v36.4,13.3 37.2,12.5 37.2,9.1 36.7,8.6 30.3,8.6 30,8.9 13.1,8.9 8.6,13.4 8.6,32.9 9,33.3 v9.6,33.3
CS_DRIVE  (via drill 0.35)
  Top 0.152: U2.10 30.89,20.09 v31.4,20.6 | v10,34.4 10,39.32 U3.8
  Bottom 0.152: v31.4,20.6 34.9,20.6 37.3,23 37.3,33.3 36.8,33.8 10.6,33.8 v10,34.4
CS_IOX  (via drill 0.35)
  Top 0.152: U3.14 17.64,25.54 v16.6,24.5
  Bottom 0.152: v16.6,24.5 16.6,20.5 17.2,19.9 18.8,19.9 19.05,20.15 IC6.7
CS_MEAS  (via drill 0.35)
  Top 0.152: U3.9 v11.3,34.41
  Bottom 0.152: U4.10 36.48,37.18 33.71,34.41 v11.3,34.41
CTRL  (via drill 0.35)
  Top 0.152: IC1.13 35.77,10.93 v36.4,10.3
  Bottom 0.152: v36.4,10.3 31.1,10.3 23.7,17.7 IC6.28
D+
  Top 0.152: J1.3 5,7.04 5.01,7.05 5.01,19.31 8.94,23.24 IC3.4
D-  (via drill 0.35)
  Top 0.152: J1.2 4.35,7.25 v4.4,7.3 | v5.65,7.3 5.65,19.52 9.44,23.31 IC3.5
  Bottom 0.152: v5.65,7.3 v4.4,7.3
DTR
  Top 0.152: 3.65,26.5 Q2.2 | 3.65,26.5 3.65,29 R9.2 | IC3.28 6.62,26.5 3.65,26.5
EN
  Top 0.152: U3.3 3.67,38.03 4.65,37.05 C18.1 R34.1 4.65,33.35 4.5,33.2 Q1.3
GND  (via drill 0.35)
  Top 0.152: IC3.3 8.44,27.52 IC3.EXP | U3.39_3 8.6,48.67 | 8.6,48.67 U3.39_6 U3.39_9 10.46,46.9 | 10.46,46.9 U3.39_8 U3.39_7 U3.39_4 | U3.39_4 U3.39_1 U3.39_2 U3.39_5 | U3.39_5 8.69,46.9 10.46,46.9 | U3.39_5 8.63,48.65 8.6,48.67 | U3.39_5 U3.39_4
  other vias: 21.6,10.4 20.3,10.4 20.3,8.1 21.6,8.1 6.4,22 5.5,22.9 6.4,24.2 7.3,23.3 22.3,51.1 22.3,50.1 21.3,51.1 21.3,50.1 22.4,55 23.4,55 24.4,55 21.4,55 33,29.5 32,29.5 34.3,27.4 35.3,27.4 0.9,59.1 39.1,59.1 39.1,0.9 39.1,1.9 39.1,2.9 38.1,0.9 37.1,0.9 39.1,28.8 39.1,27.8 39.1,26.8 39.1,25.8 39.1,24.8 39.1,23.8 39.1,22.8 39.1,21.8 5.3,48.7 5.3,46.9 5.3,45 12,48.7 12,46.8 12,45 28.2,46 29.2,46 30.2,46 28.2,45 29.2,45 30.2,45
  pour Top (rank 2): 40.08,60.08 -0.08,60.08 -0.08,-0.08 40.08,-0.08
  pour Bottom: 40.08,60.08 -0.08,60.08 -0.08,-0.08 40.08,-0.08
  pour Inner1: 0,60 40,60 40,0 0,0
GPA2  (via drill 0.35)
  Top 0.152: J2.P$13 32.4,57.3 v32,57.7
  Inner1 0.152: v32,57.7 32,53.63 31.99,53.62 31.99,47.61 32.58,47.02 32.58,41.84 30.4,39.66 30.4,32.97 v30.33,32.9
  Bottom 0.152: IC6.19 21.65,27.85 26.7,32.9 v30.33,32.9
GPA3  (via drill 0.35)
  Top 0.152: v33,57.7 33.2,57.5 J2.P$11
  Inner1 0.152: v33,57.7 33,54.2 32.3,53.49 32.3,47.8 32.89,47.21 32.89,41.72 31.3,40.13 31.3,32.96 v31.24,32.9
  Bottom 0.152: IC6.20 22.3,27.5 27.01,32.21 30.55,32.21 v31.24,32.9
GPA4  (via drill 0.35)
  Top 0.152: J2.P$14 32.4,52.4 v33.3,53.3
  Inner1 0.152: v33.3,53.3 32.6,52.6 32.6,48 33.19,47.41 33.19,41.59 32.2,40.6 32.2,32.95 v32.15,32.9
  Bottom 0.152: IC6.21 22.95,27.68 27.17,31.91 31.15,31.91 v32.15,32.9
GPA5  (via drill 0.35)
  Top 0.152: J2.P$9 v34,57.7
  Inner1 0.152: v34,57.7 34.1,57.6 34.1,50 33.2,49.1 33.2,47.9 33.5,47.6 33.5,41.4 32.99,40.89 32.99,37.95 33.06,37.88 v33.06,32.9
  Bottom 0.152: IC6.22 23.7,28 27.3,31.6 31.76,31.6 v33.06,32.9
GPA6  (via drill 0.35)
  Top 0.152: J2.P$8 34.8,49.6 v33.9,48.7
  Inner1 0.152: v33.9,48.7 33.9,48.13 33.9,38.91 34.2,38.6 34.2,33.13 v33.97,32.9
  Bottom 0.152: IC6.23 24.2,24.7 24.6,25.1 24.6,26.3 29.51,31.21 32.28,31.21 v33.97,32.9
GPA7  (via drill 0.35)
  Top 0.152: J2.P$7 34.8,57.5 v34.99,57.69 v34.99,57.7
  Inner1 0.152: v34.88,32.9 34.9,32.92 34.9,46.4 35.49,46.99 35.49,49.07 34.88,49.69 34.88,57.58 v34.99,57.69 v34.99,57.7
  Bottom 0.152: IC6.24 24.25,24.05 25,24.8 25,26.2 29.71,30.91 32.88,30.91 v34.88,32.9
GPB0  (via drill 0.35)
  Top 0.152: J2.P$12 33.2,52.3 34.2,53.3 v35.48,53.3
  Inner1 0.152: v35.78,32.9 35.8,32.92 35.8,49.2 35.48,49.52 v35.48,53.3
  Bottom 0.152: IC6.25 24.3,23.4 25.4,24.5 25.4,26.1 29.91,30.61 33.49,30.61 v35.78,32.9
GPB1  (via drill 0.35)
  Top 0.152: J2.P$10 34,52.3 34.3,52.6 35.69,52.6 v36.39,53.3
  Inner1 0.152: v36.69,32.9 v36.69,32.91 36.39,33.21 v36.39,53.3
  Bottom 0.152: IC6.26 24.25,22.75 25.8,24.3 25.8,26 30.1,30.3 34.09,30.3 v36.69,32.9
H_DAT  (via drill 0.35)
  Top 0.152: U3.16 16.8,43.4 v16.4,43 | J2.P$6 35.6,52 36.1,52.5 37,52.5 37.3,52.8 v37.3,53.3
  Bottom 0.152: v16.4,43 19.3,43 20.6,44.3 20.6,56 23.1,58.5 37.5,58.5 38.2,57.8 38.2,54.2 v37.3,53.3
H_SCLK
  Top 0.152: J2.P$5 35.6,58.1 35.2,58.5 27.5,58.5 25.4,56.4 25.4,52 21.7,48.3 21.7,42.6 20,40.9 16.9,40.9 16.37,40.37 U3.13
INT  (via drill 0.35)
  Top 0.152: IC1.12 35.42,10.28 v36.4,9.3
  Bottom 0.152: v36.4,9.3 31.5,9.3 22.95,17.85 IC6.1
IO0  (via drill 0.35)
  Top 0.152: C19.2 17.7,56.4 U3.25 17.64,58.06 v17.6,58.1 | Q2.3 1.81,27.09 v1.7,27.2 v1.69,27.2 | R35.1 1.85,20.45 v1.8,20.5
  Inner1 0.152: v17.6,58.1 16.9,58.8 2.8,58.8 1.7,57.7 v1.7,27.21 v1.69,27.2 1.69,20.61 v1.8,20.5
MSB  (via drill 0.35)
  Top 0.152: IC1.10 30.18,9.62 v30.2,9.6 | U3.7 8.8,39.29 8.8,32.81 v9.21,32.4
  Bottom 0.152: v30.2,9.6 12.9,9.6 9.21,13.29 v9.21,32.4
N$1
  Top 0.152: IC1.1 27.12,15.47 26.2,16.4 R1.1
N$2
  Top 0.152: IC1.2 26.12,14.82 25.7,14.4 C8.1
N$3
  Top 0.152: IC1.3 26.18,14.18 25.9,13.9 25.9,12.8 25.5,12.4 C9.1
N$4
  Top 0.152: IC2.4 R3.1 33.75,25.65 34.66,24.74 IC1.20
N$6
  Top 0.152: R11.1 R7.1
N$7
  Top 0.152: R13.1 R8.1
N$8
  Top 0.152: R18.2 R14.2 32.9,40.2 32.67,39.98 IC4.6
N$9
  Top 0.152: R17.1 36.55,37.9 R13.2 33.4,36.2 32.99,36.61 32.99,38.91 32.58,39.33 IC4.5
N$10
  Top 0.152: R15.1 23.05,38 R11.2 26.4,36.3 26.8,36.7 26.8,39.6 27.18,39.98 IC4.3
N$11
  Top 0.152: R16.2 R12.2 26.8,40.3 27.12,40.62 IC4.2
N$12
  Top 0.152: R16.1 24.75,44 R21.2 26.4,44.3 26.8,43.9 26.8,41.7 27.23,41.27 IC4.1
N$13
  Top 0.152: IC1.8 31.27,10.93 32.55,9.65 OS1.3
N$14
  Top 0.152: IC1.6 27.73,12.22 27.5,12 27.5,10 25.9,8.4 25.9,6.7 25.6,6.4 C2.2
N$15
  Top 0.152: R18.1 34.85,43.9 R22.2 33.4,44.2 33,43.8 33,41 32.62,40.62 IC4.7
N$16
  Top 0.152: U2.7 29.39,17.89 29.2,17.7 27.2,17.7 27,17.9 R6.1
N$18  (via drill 0.35)
  Top 0.152: R2.1 v28.1,25.65 IC2.1 | v35.6,25.6 35.6,15.1 35.33,14.82 IC1.19
  Bottom 0.152: v28.1,25.65 35.55,25.65 v35.6,25.6
N$19
  Top 0.152: U2.3 29.9,24.6 29.57,24.93 IC2.2
N$20  (via drill 0.35)
  Top 0.152: v21.8,40.3 R12.1 | v29.6,35.7 29.57,35.67 IC2.7 | v29.6,35.7 33.44,35.7 R8.2 | v29.6,35.7 v29.6,35.71
  Bottom 0.152: v29.6,35.71 27.16,35.71 27.06,35.8 26.3,35.8 v21.8,40.3
N$21
  Top 0.152: U2.2 30.41,24.49 30.23,24.68 IC2.3
N$22
  Top 0.152: U2.5 28.32,23.38 28.1,23.6 27.05,23.6 C13.1
N$23
  Bottom 0.152: U4.7 37.51,49.01 37.7,49.2 37.7,51.2 37.5,51.4 R28.1
N$24
  Bottom 0.152: IC7.26 8.18,42.27 7,41.1 6.1,41.1 5.6,40.6 R33.2
N$25
  Bottom 0.152: IC7.27 7.53,42.23 6.8,41.5 4.5,41.5 3.6,40.6 C32.2 5.3,37.05 R33.1
N$26
  Bottom 0.152: C24.1 31.95,50.45 32.12,50.28 U4.5
N$27
  Bottom 0.152: C28.2 R31.1 13.6,40.3 13,40.9 12.2,40.9 10.78,42.33 IC7.22
N$28
  Bottom 0.152: C29.2 R32.1 9.47,38.88 IC7.24
N$29
  Bottom 0.152: IC7.25 8.82,42.23 7.6,41 C31.2
N$30
  Bottom 0.152: IC7.21 11.43,42.27 12.4,41.3 16.9,41.3 17.6,40.6 C30.2
N$31
  Bottom 0.152: U4.3 31.1,48.5 30.77,48.83 IC5.2
N$32
  Bottom 0.152: IC7.15 15.32,44.23 17.1,46 17.6,46 OS2.3
N$33
  Bottom 0.152: R29.2 23.77,48.83 IC5.7
N$34
  Bottom 0.152: C21.2 R24.2
N$35
  Bottom 0.152: R25.2 R24.1 28.8,47.9 29.18,47.52 IC5.4
N$36
  Bottom 0.152: R27.2 R26.1 34.8,52.8 34.5,52.5 30.6,52.5 29.85,51.75 IC5.1
N$37
  Bottom 0.152: C22.2 R26.2
N$39
  Bottom 0.152: U4.2 30.91,47.99 30.7,48.2 29.88,48.2 IC5.3
N$40
  Bottom 0.152: C27.1 R30.2 R29.1
  Bottom 0.406: C27.1 22.05,43.75 20.9,42.6 20.9,35.9 20.2,35.2 4.3,35.2 3.6,35.9 C32.1
N$42
  Top 0.152: IC3.11 11.72,28.02 12,28.3 12,30.5 12.6,31.1 R20.2
N$43
  Top 0.152: R4.1 R5.1 12.37,26.52 IC3.8
N$45
  Top 0.152: U3.24 21.8,53.55 R23.2
N$71
  Top 0.152: IC3.9 12.02,27.02 12.4,27.4 12.4,28.7 12.8,29.1 R19.1
N$75
  Top 0.152: Q1.1 1.75,29.2 R9.1
N$76
  Top 0.152: Q2.1 1.75,23.1 R10.1
N$81  (via drill 0.35)
  Top 0.254: v27.8,53.5 29.7,53.5 30.8,52.4 J2.P$18
  Bottom 0.254: C21.1 27.8,53.85 v27.8,53.5
N$82  (via drill 0.35)
  Top 0.254: J2.P$17 v30.8,53.5
  Bottom 0.254: v30.8,53.5 32.4,53.5 32.8,53.9 C22.1
N$83  (via drill 0.35)
  Top 0.152: R15.2 v25.8,38.3
  Top 0.254: C38.2 v25.8,46.3 25.8,49 26.6,49.8 26.6,55.1 28.2,56.7 31.2,56.7 31.6,56.3 J2.P$15
  Bottom 0.152: v25.8,46.3 v25.8,38.3
N$84  (via drill 0.35)
  Top 0.152: R17.2 v33.59,38.2
  Top 0.254: C39.2 34.9,46.25 v34.9,47.4 | J2.P$16 31.6,48.6 32.8,47.4 v34.9,47.4 | v34.89,47.4 v34.9,47.4
  Bottom 0.152: v33.59,38.2 33.7,38.2 34.89,39.39 v34.89,47.4
N$85
  Top 0.152: C38.1 R21.1
N$86
  Top 0.152: R22.1 C39.1
OE  (via drill 0.35)
  Inner1 0.152: v15.2,45.2 14.6,44.6 14.6,37.3 15.7,36.2 v15.7,33.19
  Bottom 0.152: IC7.16 14.68,44.67 v15.2,45.2 | v15.7,33.19 21,27.89 IC6.18
PWR  (via drill 0.35)
  Inner1 0.152: v14.29,45.2 14.29,37.11 14.7,36.7 v14.7,33.19
  Bottom 0.152: IC7.17 14.03,44.92 v14.29,45.19 v14.29,45.2 | v14.7,33.19 20.35,27.54 IC6.17
RTS  (via drill 0.35)
  Top 0.152: Q1.2 4.5,31 4.9,30.6 v4.9,29 4.92,29.02 5.78,29.02 6.28,28.52 IC3.24 | R10.2 4.4,23 4.9,23.5 v4.9,25.6
  Bottom 0.152: v4.9,29 v4.9,25.6
RXD0  (via drill 0.35)
  Top 0.152: IC3.26 6.02,27.52 v5.7,27.2 | U3.34 v6.21,58.09 v6.2,58.1
  Inner1 0.152: v6.2,58.1 6.2,57.5 4.6,55.9 4.6,31.1 6.4,29.3 6.4,27.8 5.8,27.2 v5.7,27.2
STBY  (via drill 0.35)
  Top 0.152: IC1.17 35.62,13.53 v36.4,14.3
  Bottom 0.152: v36.4,14.3 27.7,14.3 24.39,17.61 24.39,22.01 24.3,22.1 IC6.27
TXD0  (via drill 0.35)
  Top 0.152: IC3.25 5.88,28.02 v5.7,28.2 | U3.35 4.94,58.06 v4.9,58.1
  Inner1 0.152: v4.9,58.1 4.9,56.73 4.29,56.13 4.29,30.97 5.7,29.57 v5.7,28.2
V_DAT  (via drill 0.35)
  Top 0.152: IC1.14 36.12,11.57 v36.4,11.3 | U3.37 2.4,57.4 v3.1,58.1 | U2.8 29.9,20.1 v29.4,20.6
  Inner1 0.152: v36.4,11.3 35.9,11.3 29.4,17.8 v29.4,20.6 29.4,22.1 | 29.4,22.1 29.4,24.7 38.5,33.8 38.5,46.1 37.6,47 37.6,48.1 38,48.5 v38.2,48.5 | 29.4,22.1 v17.3,22.1 7.4,22.1 2.3,27.2 2.3,57.3 v3.1,58.1
  Bottom 0.152: U4.8 v38.2,48.5 | v17.3,22.1 IC6.9
V_SCLK  (via drill 0.35)
  Top 0.152: IC1.15 36.33,12.22 v36.4,12.3 | U3.30 v11.29,58.09 v11.3,58.1 | v30.4,20.6 v30.41,20.59 U2.9 30.41,18.11 29.6,17.3 26.5,17.3 25.4,18.4 v25.4,21.1 v25.4,22.8
  Inner1 0.152: v36.4,12.3 35.4,12.3 30.4,17.3 v30.4,20.6 30.4,25.2 38.9,33.7 38.9,46.81 v38.21,47.5 | v25.4,21.1 v17.3,21.1 | v11.3,58.1 16.3,58.1 23.3,51.1 23.3,26 25.4,23.9 v25.4,22.8
  Bottom 0.152: U4.9 37.71,47.99 v38.2,47.5 v38.21,47.5 | IC6.8 17.65,21.45 v17.3,21.1